# Altium project BEE-1012 PAY-EXP_V110.PrjPcb (part 2 of 7)

## Sheet 08_SAMA7G54-PMIC.SchDoc
size 420 x 297 mm; SheetNumber: 14; SheetTotal: 35
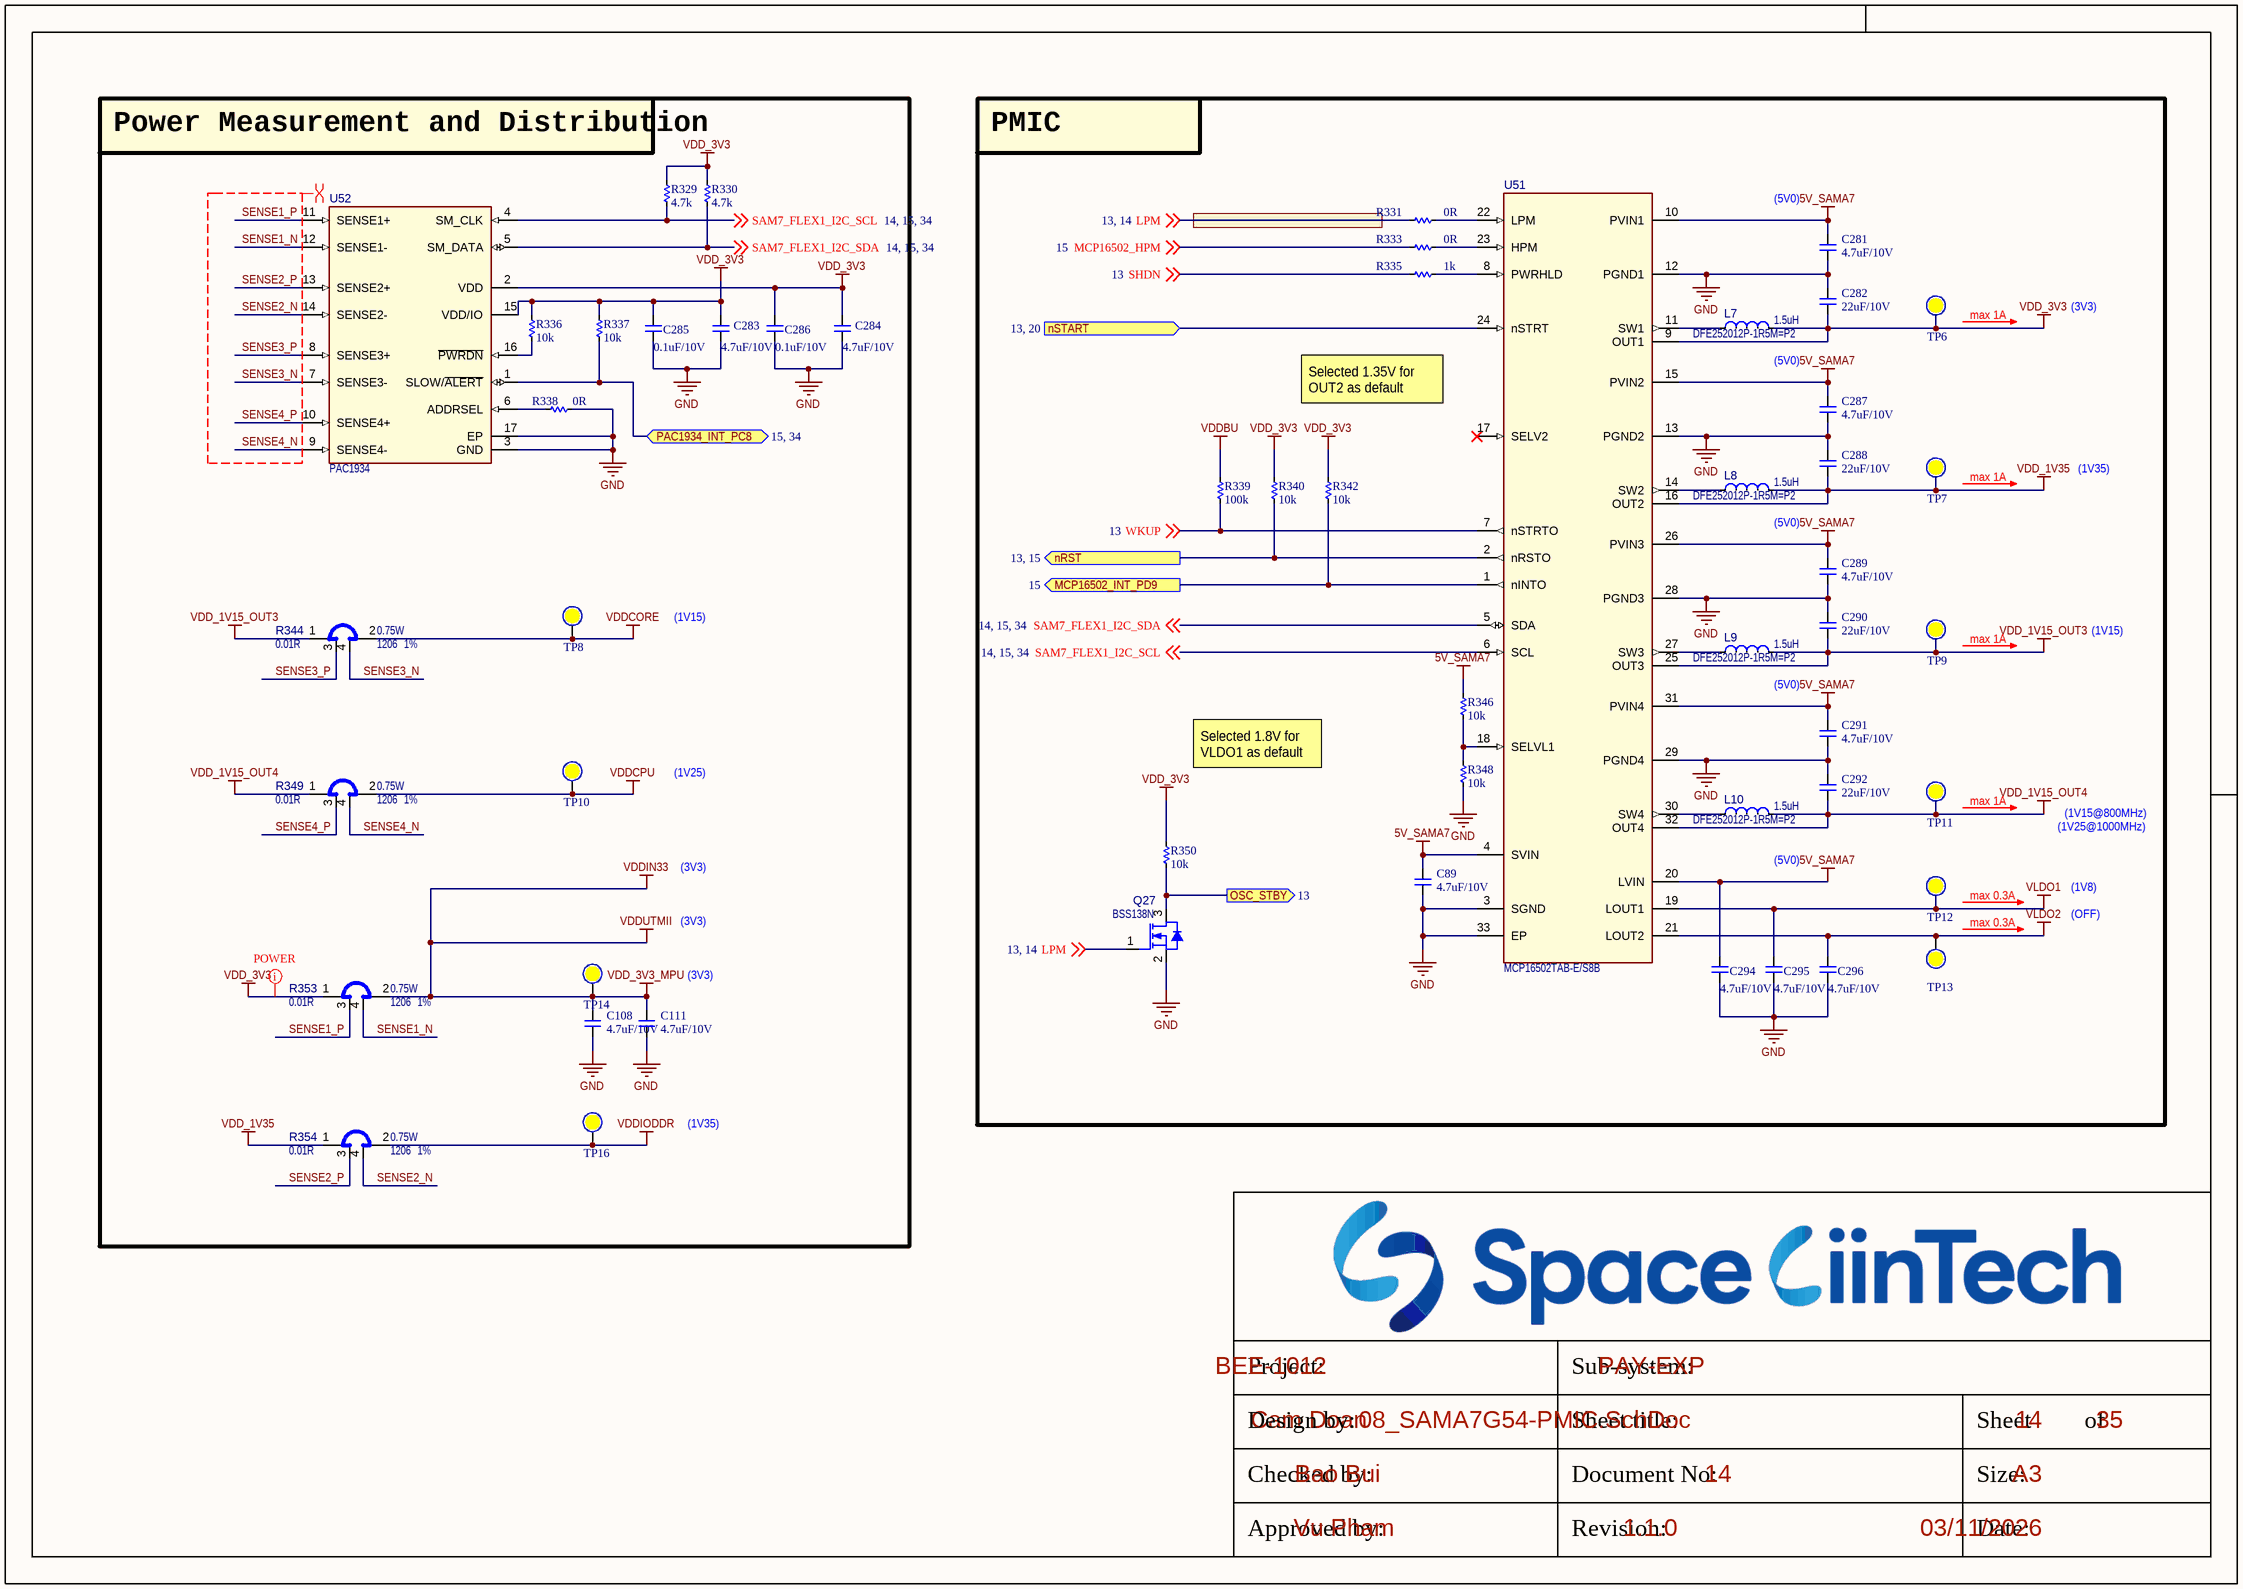
[diagram p12: 08_SAMA7G54-PMIC.SchDoc]

### Parts
C89  4.7uF/10V  [CAP_C_1005X50_L]
C108  4.7uF/10V  [CAP_C_1005X50_L]
C111  4.7uF/10V  [CAP_C_1005X50_L]
C281  4.7uF/10V  [CAP_C_1005X50_L]
C282  22uF/10V  [CAP_C_1608X80]
C283  4.7uF/10V  [CAP_C_1005X50_L]
C284  4.7uF/10V  [CAP_C_1005X50_L]
C285  0.1uF/10V  [CAP_C_1005X50_L]
C286  0.1uF/10V  [CAP_C_1005X60]
C287  4.7uF/10V  [CAP_C_1005X50_L]
C288  22uF/10V  [CAP_C_1608X80]
C289  4.7uF/10V  [CAP_C_1005X50_L]
C290  22uF/10V  [CAP_C_1608X80]
C291  4.7uF/10V  [CAP_C_1005X50_L]
C292  22uF/10V  [CAP_C_1608X80]
C294  4.7uF/10V  [CAP_C_1005X50_L]
C295  4.7uF/10V  [CAP_C_1005X50_L]
C296  4.7uF/10V  [CAP_C_1005X50_L]
L7  value 1.5uH  [IND_C_1008]  (hidden comment: DFE252012P-1R5M=P2)
L8  value 1.5uH  [IND_C_1008]  (hidden comment: DFE252012P-1R5M=P2)
L9  value 1.5uH  [IND_C_1008]  (hidden comment: DFE252012P-1R5M=P2)
L10  value 1.5uH  [IND_C_1008]  (hidden comment: DFE252012P-1R5M=P2)
Q27  value BSS138N  [SOT-23-3]  (hidden comment: BSS138NH6327XTSA2)
R329  4.7k  [RES_C_1005X40]
R330  4.7k  [RES_C_1005X40]
R331  0R  [RES_C_1608X60]
R333  0R  [RES_C_1608X60]
R335  1k  [RES_C_1005X40]
R336  10k  [RES_C_1005X40]
R337  10k  [RES_C_1005X40]
R338  0R  [RES_C_1005X40]
R339  100k  [RES_C_1005X40]
R340  10k  [RES_C_1005X40]
R342  10k  [RES_C_1005X40]
R344  value 0.01R  Package: 1206  Tolerance: 1%  Power: 0.75W  [RES_C_1206_SHUNT]  (hidden comment: KRL1632E-M-R010-F-T5)
R346  10k  [RES_C_1005X40]
R348  10k  [RES_C_1005X40]
R349  value 0.01R  Package: 1206  Tolerance: 1%  Power: 0.75W  [RES_C_1206_SHUNT]  (hidden comment: KRL1632E-M-R010-F-T5)
R350  10k  [RES_C_1005X40]
R353  value 0.01R  Package: 1206  Tolerance: 1%  Power: 0.75W  [RES_C_1206_SHUNT]  (hidden comment: KRL1632E-M-R010-F-T5)
R354  value 0.01R  Package: 1206  Tolerance: 1%  Power: 0.75W  [RES_C_1206_SHUNT]  (hidden comment: KRL1632E-M-R010-F-T5)
TP6  (no value)  [Testpoint_80]  (no BOM)
TP7  (no value)  [Testpoint_80]  (no BOM)
TP8  (no value)  [Testpoint_80]  (no BOM)
TP9  (no value)  [Testpoint_80]  (no BOM)
TP10  (no value)  [Testpoint_80]  (no BOM)
TP11  (no value)  [Testpoint_80]  (no BOM)
TP12  (no value)  [Testpoint_80]  (no BOM)
TP13  (no value)  [Testpoint_80]  (no BOM)
TP14  (no value)  [Testpoint_80]  (no BOM)
TP16  (no value)  [Testpoint_80]  (no BOM)
U51  value MCP16502TAB-E/S8B  [QFN-32_5X5_EP3.7X3.7]  (hidden comment: MCP16502 QFN-32)
U52  value PAC1934  [UQFN-16_4X4_EP2.6X2.6]  (hidden comment: PAC1934 UQFN-16)

### Blocks framed on the sheet
Power Measurement and Distribution: C108 C111 C283-C286 R329 R330 R336-R338 R344 R349 R353 R354 TP8 TP10 TP14 TP16 U52
PMIC: C89 C281 C282 C287-C292 C294-C296 L7-L10 Q27 R331 R333 R335 R339 R340 R342 R346 R348 R350 TP6 TP7 TP9 TP11-TP13 U51

### Ports
MCP16502_INT_PD9 (out, see 15), nRST (out, see 13, 15), nSTART (in, see 13, 20), OSC_STBY (out, see 13), PAC1934_INT_PC8 (bidir, see 15, 34)

### Nets
5V_SAMA7: C89.1 C281.1 C287.1 C289.1 C291.1 C294.1 R346.1 U51.4(SVIN) U51.10(PVIN1) U51.15(PVIN2) U51.20(LVIN) U51.26(PVIN3) U51.31(PVIN4)
GND: C89.2 C108.2 C111.2 C281.2 C282.1 C283.2 C284.2 C285.2 C286.2 C287.2 C288.1 C289.2 C290.1 C291.2 C292.1 C294.2 C295.2 C296.2 Q27.2(S) R338.2 R348.2 U51.3(SGND) U51.12(PGND1) U51.13(PGND2) U51.28(PGND3) U51.29(PGND4) U51.33(EP) U52.3(GND) U52.17(EP)
VDD_1V15_OUT3: C290.2 L9.2(F) R344.1 TP9.1 U51.25(OUT3)
VDD_1V15_OUT4: C292.2 L10.2(F) R349.1 TP11.1 U51.32(OUT4)
VDD_1V35: C288.2 L8.2(F) R354.1 TP7.1 U51.16(OUT2)
VDD_3V3: C282.2 C283.1 C284.1 C285.1 C286.1 L7.2(F) R329.1 R330.1 R336.1 R337.1 R340.2 R342.2 R350.1 R353.1 TP6.1 U51.9(OUT1) U52.2(VDD) U52.15(VDD/IO)
VDD_3V3_MPU: C108.1 C111.1 R339.2 R353.2 TP14.1  [also labelled VDDBU, VDDIN33, VDDUTMII]
VDDCORE: R344.2 TP8.1
VDDCPU: R349.2 TP10.1
VDDIODDR: R354.2 TP16.1
VLDO1: C295.1 TP12.1 U51.19(LOUT1)
VLDO2: C296.1 TP13.1 U51.21(LOUT2)
CPU_WD_nRESET: R340.1 U51.2(nRSTO) ; port nRST
LPM: Q27.1(G) R331.1 ; off-sheet LPM
MCP16502_HPM: R333.1 ; off-sheet MCP16502_HPM
SAM7_FLEX1_I2C_SCL: R329.2 U51.6(SCL) U52.4(SM_CLK) ; off-sheet SAM7_FLEX1_I2C_SCL
SAM7_FLEX1_I2C_SDA: R330.2 U51.5(SDA) U52.5(SM_DATA) ; off-sheet SAM7_FLEX1_I2C_SDA
SENSE1_N: R353.4 U52.12(SENSE1-)
SENSE1_P: R353.3 U52.11(SENSE1+)
SENSE2_N: R354.4 U52.14(SENSE2-)
SENSE2_P: R354.3 U52.13(SENSE2+)
SENSE3_N: R344.4 U52.7(SENSE3-)
SENSE3_P: R344.3 U52.8(SENSE3+)
SENSE4_N: R349.4 U52.9(SENSE4-)
SENSE4_P: R349.3 U52.10(SENSE4+)
SHDN: R335.1 ; off-sheet SHDN
WKUP: R339.1 U51.7(nSTRTO) ; off-sheet WKUP
NetC355_1: U51.24(nSTRT) ; port nSTART
NetL7_1: L7.1(S) U51.11(SW1)
NetL8_1: L8.1(S) U51.14(SW2)
NetL9_1: L9.1(S) U51.27(SW3)
NetL10_1: L10.1(S) U51.30(SW4)
NetQ27_3: Q27.3(D) R350.2 ; port OSC_STBY
NetR331_2: R331.2 U51.22(LPM)
NetR333_2: R333.2 U51.23(HPM)
NetR335_2: R335.2 U51.8(PWRHLD)
NetR336_2: R336.2 U52.16(~{PWRDN})
NetR337_2: R337.2 U52.1(SLOW/~{ALERT}) ; port PAC1934_INT_PC8
NetR338_1: R338.1 U52.6(ADDRSEL)
NetR342_1: R342.1 U51.1(nINTO) ; port MCP16502_INT_PD9
NetR346_2: R346.2 R348.1 U51.18(SELVL1)

Not connected (* = marked no-connect by the designer): U51 17(SELV2)*

### Layout directives
differential pair: SENSE1_N, SENSE1_P, SENSE2_N, SENSE2_P, SENSE3_N, SENSE3_P, SENSE4_N, SENSE4_P
net class POWER: VDD_3V3

### Notes on the sheet
- (near C281) (5V0)
- (near TP6) max 1A
- (3V3)
- Selected 1.35V for OUT2 as default
- (5V0)
- (near TP7) max 1A
- (1V35)
- (1V15)
- (near TP9) max 1A
- (1V25)
- Selected 1.8V for VLDO1 as default
- (near TP11) max 1A
- (near L10) (5V0)
- (1V25@1000MHz)
- (1V15@800MHz)
- (near TP12) max 0.3A
- max 0.3A
- (1V8)
- (OFF)
- Project:
- Sub-system:
- Design by:
- Sheet title:
- Sheet
- of
- Checked by:
- Approved by:
- Revision:
- Document No:
- Size:
- Date:
- A3

### Library data of the parts
C89 C108 C111 C281-C292 C294-C296 = _CAP_C_2: CAP
L7-L10 = IND1335: Inductor; Manufacturer 1: Murata Electronics North America; Description_: INDUCTOR 1.5uH 3.5A 20% SMD 1008; Dev Tools Status: Design; Owner: Razvan Cristescu; DCR: 0.06R; RMS Current: 3.5A; Test Frequency: 1MHz; Populated: YES; MCHP-ID: IND1335; Revision: A; Symbol: Inductor; Status: MCL Design; ComponentLink1URL: https://chn-vm-apps.microchip.com/mchprepo/parts/Datasheets/m_dfe252012p.pdf; ComponentLink1Description: SVN Datasheet; ComponentLink2URL: C:\ALTIUM_WORK\00001_MCHP-CDB\Datasheets\m_dfe252012p.pdf; ComponentLink2Description: Local Datasheet; ComponentLink3URL: C:\ALTIUM_WORK\00001_MCHP-CDB\Library\LibraryRefs\Inductor.SchLib; ComponentLink3Description: Open Symbol; ComponentLink4URL: C:\ALTIUM_WORK\00001_MCHP-CDB\Library\Footprints\IND_C_1008.PcbLib; ComponentLink4Description: Open Footprint; ComponentLink5Description: Open Footprint 2; ComponentLink6Description: Open Footprint 3; ComponentLink7Description: Open Footprint 4; Package: 1008; Type: Inductor; Category: Inductor; Manufacturer Part Number 1: DFE252012P-1R5M=P2; Supplier 1: Digi-Key; Supplier Part Number 1: 490-10648-6-ND; Quantity Override: 1
Q27 = TRA1223: Transistor MOS; Manufacturer 1: Infineon Technologies; Description_: TRANS FET N-CH BSS138N 60V 230mA SOT23-3; Dev Tools Status: Production; Type: FET; Current: 230mA; Drain to Source Voltage: 60V; Gate to Source Voltage: 20V; Power: 0.36W; Owner: Dragos Danaila; Populated: YES; MCHP-ID: TRA1223; Revision: 1; Symbol: Transistor MOS-N GSD; Status: MCL Design; Package: SOT23-3; ComponentLink1URL: https://chn-vm-apps.microchip.com/mchprepo/parts/Datasheets/Infineon-BSS138N-DS-v02_86-en.pdf; ComponentLink1Description: SVN Datasheet; ComponentLink2URL: C:\ALTIUM_WORK\00001_MCHP-CDB\Datasheets\Infineon-BSS138N-DS-v02_86-en.pdf; ComponentLink2Description: Local Datasheet; ComponentLink3URL: C:\ALTIUM_WORK\00001_MCHP-CDB\Library\LibraryRefs\Transistor MOS-N GSD.SchLib; ComponentLink3Description: Open Symbol; ComponentLink4URL: C:\ALTIUM_WORK\00001_MCHP-CDB\Library\Footprints\SOT-23-3.PcbLib; ComponentLink4Description: Open Footprint; ComponentLink5Description: Open Footprint 2; ComponentLink6Description: Open Footprint 3; ComponentLink7Description: Open Footprint 4; Operating Temperature: -55C to +150C; Category: Transistor; Voltage: 60V; Manufacturer Part Number 1: BSS138NH6327XTSA2; Supplier 1: Digi-Key; Supplier Part Number 1: BSS138NH6327XTSA2CT-ND; Quantity Override: 1
R329-R331 R333 R335-R340 R342 R346 R348 R350 = _RES_B_2: RES
R344 R349 R353 R354 = RSMT1316: Shunt; Manufacturer 1: SUSUMU; Description_: RES SHUNT MF 0.01R 1% 0.75W SMD 1206; Dev Tools Status: Design; Temperature Coeffcient: 50ppm/C; Current: 8A; Owner: Ciprian Abramov; Populated: YES; MCHP-ID: RSMT1316; Revision: 1; Symbol: Shunt 4 Pin; Status: MCL Design; ComponentLink1URL: https://chn-vm-apps.microchip.com/mchprepo/parts/Datasheets/n_catalog_partition09_en.pdf; ComponentLink1Description: SVN Datasheet; ComponentLink2URL: C:\ALTIUM_WORK\00001_MCHP-CDB\Datasheets\n_catalog_partition09_en.pdf; ComponentLink2Description: Local Datasheet; ComponentLink3URL: C:\ALTIUM_WORK\00001_MCHP-CDB\Library\LibraryRefs\Shunt 4 Pin.SchLib; ComponentLink3Description: Open Symbol; ComponentLink4URL: C:\ALTIUM_WORK\00001_MCHP-CDB\Library\Footprints\RES_C_1206_SHUNT.PcbLib; ComponentLink4Description: Open Footprint; ComponentLink5Description: Open Footprint 2; ComponentLink6Description: Open Footprint 3; ComponentLink7Description: Open Footprint 4; Operating Temperature: -55C to +155C; Category: Resistor; Type: RES SMD; Composition: MF; Manufacturer Part Number 1: KRL1632E-M-R010-F-T5; Supplier 1: Digi-Key; Supplier Part Number 1: 408-1570-1-ND; Quantity Override: 1
TP6-TP14 TP16 = Test Point: Solder: NF
U51 = MIC8878: Manufacturer 1: Microchip Technology; Populated: YES; Description_: MCHP ANALOG PMIC SWITCHER Buck ADJ MCP16502TAB-E/S8B QFN-32 for SAMA7G5 MPU with LPDDR/DDR2/DDR3; Dev Tools Status: Design; Owner: Dragos Danaila; MCHP-ID: MIC8878; Symbol: MCP16502 QFN-32; Type: Switcher; Status: MCL Design; Revision: 1; Category: MCHP-Analog; ComponentLink1Description: SVN Datasheet; ComponentLink2Description: Local Datasheet; ComponentLink3URL: C:\ALTIUM_WORK\00001_MCHP-CDB\Library\LibraryRefs\MCP16502 QFN-32.SchLib; ComponentLink3Description: Open Symbol; ComponentLink4URL: C:\ALTIUM_WORK\00001_MCHP-CDB\Library\Footprints\QFN-32_5X5_EP3.7X3.7.PcbLib; ComponentLink4Description: Open Footprint; ComponentLink5Description: Open Footprint 2; ComponentLink6Description: Open Footprint 3; ComponentLink7Description: Open Footprint 4; Manufacturer Part Number 1: MCP16502TAB-E/S8B; Supplier 1: Digi-Key; Supplier Part Number 1: 150-MCP16502TAB-E/S8BCT-ND; Quantity Override: 1; ComponentLink2URL: C:\ALTIUM_WORK\00001_MCHP-CDB\Datasheets\MCP16502-High-Performance-PMIC-for-SAMA5DX-SAM9X6-MPUs-Data-Sheet-DS20006275B.pdf
U52 = MIC8883: Manufacturer 1: Microchip Technology; Manufacturer Part Number 1: PAC1934T-I/JQ; Description_: MCHP ANALOG POWER CURRENT SENSE MONITOR PAC1934T-I/JQ UQFN-16; Dev Tools Status: Design; Owner: Ciprian Abramov; Populated: YES; MCHP-ID: MIC8883; Symbol: PAC1934 UQFN-16; Type: Power/Current Sensor; Status: MCL Design; Revision: 1; Category: MCHP-Analog; ComponentLink1Description: SVN Datasheet; ComponentLink2Description: Local Datasheet; ComponentLink3URL: C:\ALTIUM_WORK\00001_MCHP-CDB\Library\LibraryRefs\PAC1934 UQFN-16.SchLib; ComponentLink3Description: Open Symbol; ComponentLink4URL: C:\ALTIUM_WORK\00001_MCHP-CDB\Library\Footprints\UQFN-16_4X4_EP2.6X2.6.PcbLib; ComponentLink4Description: Open Footprint; ComponentLink5Description: Open Footprint 2; ComponentLink6Description: Open Footprint 3; ComponentLink7Description: Open Footprint 4; Supplier 1: Digi-Key; Supplier Part Number 1: PAC1934T-I/JQCT-ND; Quantity Override: 1